# EasyEDA Pro project Tracer-DIY.epro

# Schematic Tracer-DIY
Board Name: Tracer-DIY; Create Date: 2025-10-20; Page Name: P1; Project Name: Tracer; Schematic Name: Tracer-DIY; Update Date: 2025-10-20; Company: EasyEDA.com; Page Size: A4; Version: V1.0
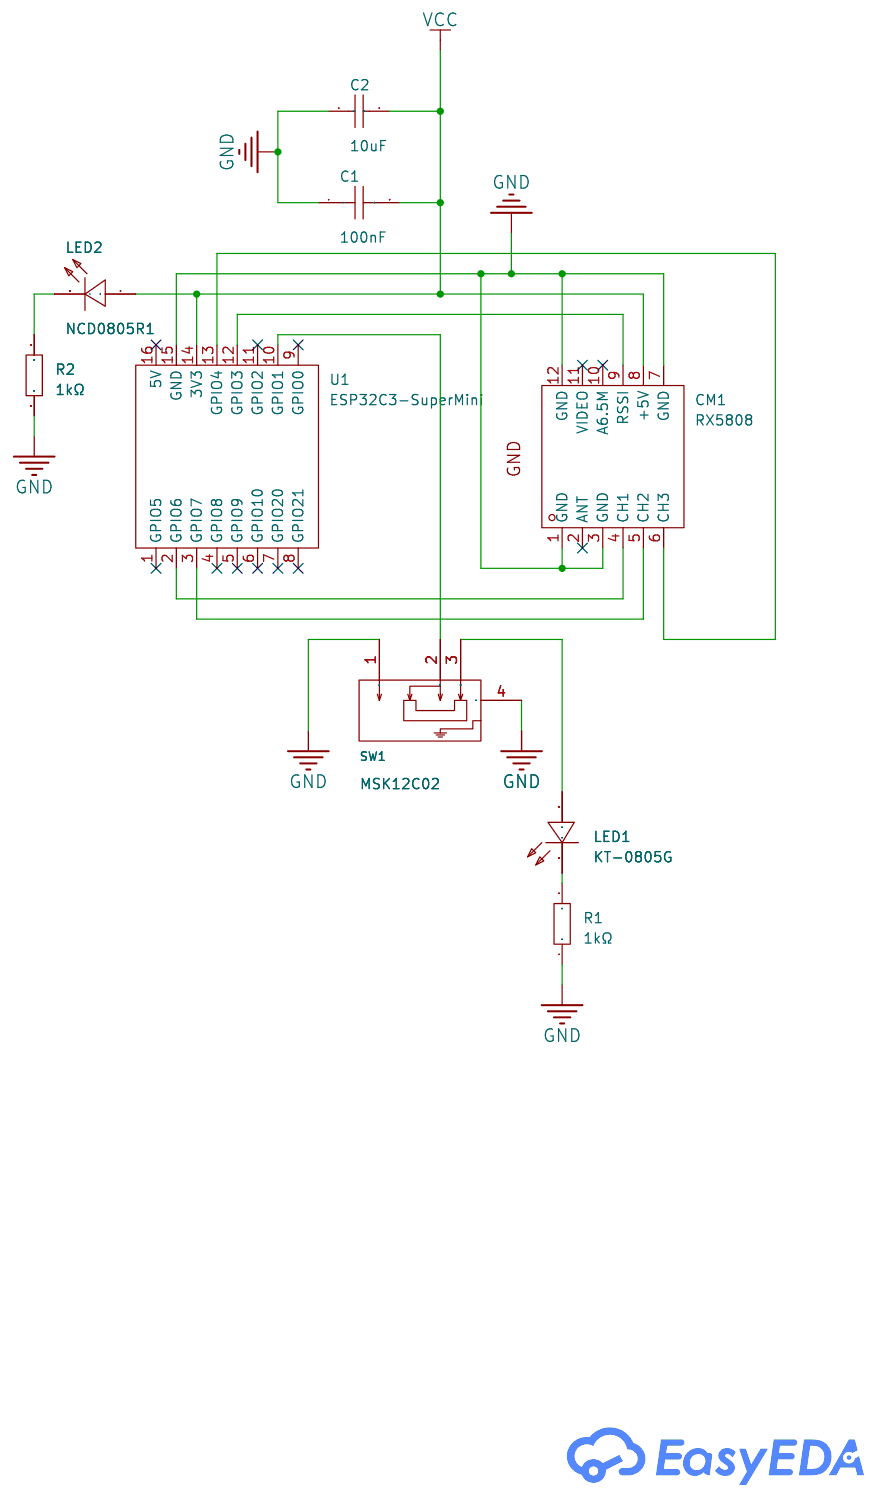
[diagram p0: schematic sheet]

## Parts
C1  100nF  [C0402]
C2  10uF  [C0402]
CM1  RX5808  [COMM-SMD_12P_RX5808]
LED1  KT-0805G  [LED0805-R-RD]
LED2  NCD0805R1  [LED0805-R-RD]
R1  1kΩ  [R0402]
R2  1kΩ  [R0402]
SW1  MSK12C02  [SW-TH_MSK12C02]
U1  ESP32C3-SuperMini  [COMM-SMD_16P-L22.5-W18.0-P2.54-TL]

## Library data of the parts
C1 = CL05B104KB54PNC: Capacitance:100nF Tolerance:±10% Tolerance:±10% Voltage Rating:50V Temperature Coefficient:X7R; LCSC Part Name: 100nF ±10% 50V; Supplier Part: C307331; Manufacturer: SAMSUNG(三星); Supplier Footprint: 0402; JLCPCB Part Class: Basic Part; Datasheet: https://item.szlcsc.com/datasheet/CL05B104KB54PNC/291005.html; Supplier: LCSC; Tolerance: ±10%; Voltage Rating: 50V; Temperature Coefficient: X7R
C2 = CL05A106MQ5NUNC: Capacitance:10uF Tolerance:±20% Tolerance:±20% Voltage Rating:6.3V Temperature Coefficient:X5R; LCSC Part Name: 10uF ±20% 6.3V; Supplier Part: C15525; Manufacturer: SAMSUNG(三星); Supplier Footprint: 0402; JLCPCB Part Class: Basic Part; Datasheet: https://item.szlcsc.com/datasheet/CL05A106MQ5NUNC/16204.html; Supplier: LCSC; Tolerance: ±20%; Voltage Rating: 6.3V; Temperature Coefficient: X5R
CM1 = RX5808: Supplier Part: C2908157; Supplier Footprint: SMD-12_23.0X28.0X2.54P; JLCPCB Part Class: Extended Part; Supplier: LCSC
LED1 = KT-0805G: Lamp Holder Type:- Illumination Color:Emerald Green Voltage - Forward(Vf):2.6V~3.1V Voltage - Forward(Vf):2.6V~3.1V Power(Watts):100mW Forward Current:5mA Wavelength - Dominant:513nm~528nm Wavelength - Dominant:513nm~528nm Peak Wavelength:525nm Diode Conf; LCSC Part Name: 0805 翠绿 高亮; Supplier Part: C2297; Manufacturer: KENTO; Supplier Footprint: 0805; JLCPCB Part Class: Basic Part; Datasheet: https://item.szlcsc.com/datasheet/KT-0805G/2670.html; Supplier: LCSC; Illumination Color: Emerald Green; Voltage - Forward(Vf): 2.6V~3.1V; Power(Watts): 100mW; Forward Current: 5mA; Wavelength - Dominant: 513nm~528nm; Peak Wavelength: 525nm; Luminous Intensity: 430mcd; Viewing Angle: 120°; Operating Temperature: -40℃~+85℃
LED2 = NCD0805R1_C84256: Lamp Holder Type:- Emitted Color:Red Forward Voltage (VF):1.6V~2.6V Forward Voltage (VF):1.6V~2.6V Power Dissipation:65mW Forward Current:20mA Dominant Wavelength:615nm~630nm Dominant Wavelength:615nm~630nm Peak Wavelength:- Diode Configuration:独立二极管 Lens; Supplier Part: C84256; Manufacturer: 国星光电; Supplier Footprint: 0805; JLCPCB Part Class: Basic Part; Datasheet: https://atta.szlcsc.com/upload/public/pdf/source/20200820/C84256_F0A75A43B3EAD75808600A0514C76B99.pdf; Supplier: LCSC; Emitted Color: Red; Forward Voltage (VF): 1.6V~2.6V; Power Dissipation: 65mW; Forward Current: 20mA; Dominant Wavelength: 615nm~630nm; Diode Configuration: 独立二极管; Lens Color: 无色透明透镜; Luminous Intensity: 67mcd~195mcd; Viewing Angle: 130°; Operating Temperature: -30℃~+85℃
R1 R2 = 0402WGF1001TCE: Type:Thick Film Resistor Resistance:1kΩ Tolerance:±1% Tolerance:±1% Power(Watts):62.5mW Voltage-Supply(Max):50V Temperature Coefficient:±100ppm/℃ Temperature Coefficient:±100ppm/℃ Operating Temperature:-55℃~+155℃ Operating Temperature:-55℃~+155℃; LCSC Part Name: 1kΩ ±1% 62.5mW 厚膜电阻; Supplier Part: C11702; Manufacturer: UNI-ROYAL(厚声); Supplier Footprint: 0402; JLCPCB Part Class: Basic Part; Datasheet: https://item.szlcsc.com/datasheet/0402WGF1001TCE/12256.html; Supplier: LCSC; Type: Thick Film Resistor; Tolerance: ±1%; Power(Watts): 62.5mW; Voltage-Supply(Max): 50V; Temperature Coefficient: ±100ppm/℃; Operating Temperature: -55℃~+155℃
SW1 = MSK12C02: Circuit:SPDT Actuator Style:- Termination Style:SMD(SMT) Tab Length:8mm Width:2.8mm Switch Height:1.4mm Mounting Type:Surface Mount, Right Angle Actuator Color:- Current Rating:50mA Voltage Rating:12V Life:10,000 Cycles Operating Temperature:-20℃~+70℃ Ope; LCSC Part Name: 两档侧拨贴片 7脚 滑动开关; Supplier Part: C431540; Manufacturer: SHOU HAN(首韩); Supplier Footprint: SMD,8x2.8mm; JLCPCB Part Class: Extended Part; Datasheet: https://item.szlcsc.com/datasheet/MSK12C02/427897.html; Supplier: LCSC; Circuit: SPDT; Termination Style: SMD(SMT) Tab; Length: 8mm; Width: 2.8mm; Switch Height: 1.4mm; Mounting Type: Surface Mount, Right Angle; Current Rating: 50mA; Voltage Rating: 12V; Life: 10,000 Cycles; Operating Temperature: -20℃~+70℃
U1 = ESP32C3-SuperMini: Supplier Part: C9900147397; Supplier Footprint: SMD-16P; JLCPCB Part Class: Extended Part; Supplier: LCSC

## Nets
GND: C1.1 C2.1 CM1.1(GND) CM1.3(GND) CM1.7(GND) CM1.12(GND) R1.1 R2.2 SW1.1 SW1.4 U1.15(GND)
VCC: C1.2 C2.2 CM1.8(+5V) LED2.1(+) U1.14(3V3)
$1N355: CM1.9(RSSI) U1.12(GPIO3)
$1N426: CM1.4(CH1) U1.2(GPIO6)
$1N432: CM1.5(CH2) U1.3(GPIO7)
$1N438: CM1.6(CH3) U1.13(GPIO4)
$1N594: LED1.1(A) SW1.3
$1N700: LED1.2(K) R1.2
$1N724: SW1.2 U1.10(GPIO1)
$1N865: LED2.2(-) R2.1

Not connected (* = marked no-connect by the designer): CM1 2(ANT)* 10(A6.5M)* 11(VIDEO)*; U1 1(GPIO5)* 4(GPIO8)* 5(GPIO9)* 6(GPIO10)* 7(GPIO20)* 8(GPIO21)* 9(GPIO0)* 11(GPIO2)* 16(5V)*

# Board Tracer-DIY
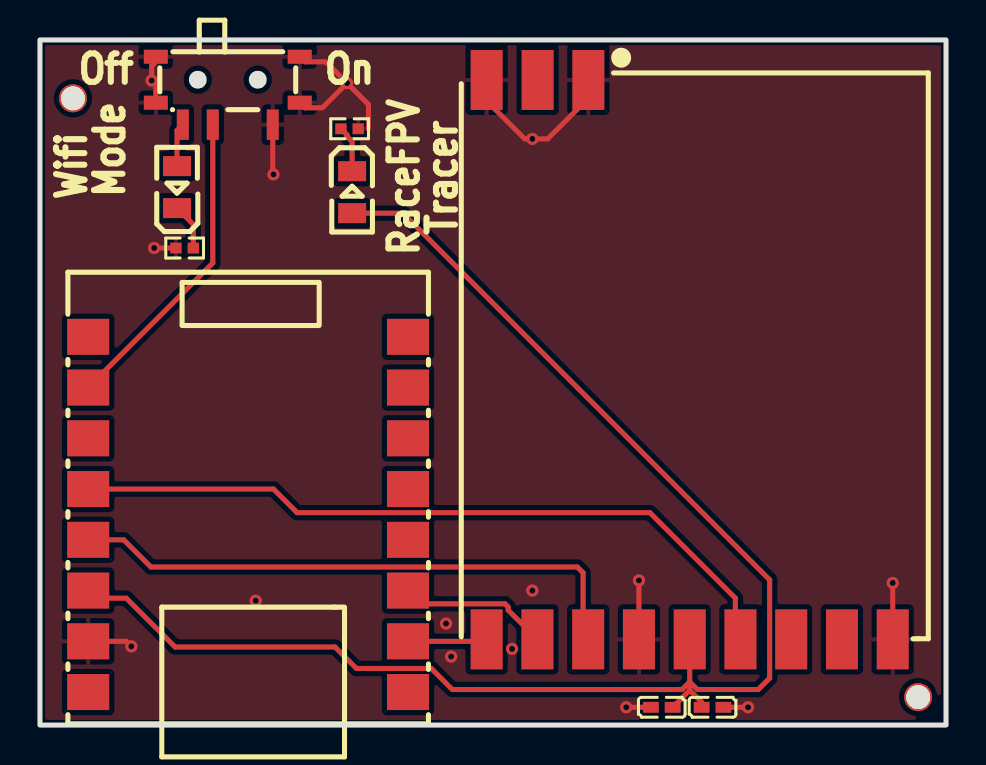
[diagram p1: board, top side]
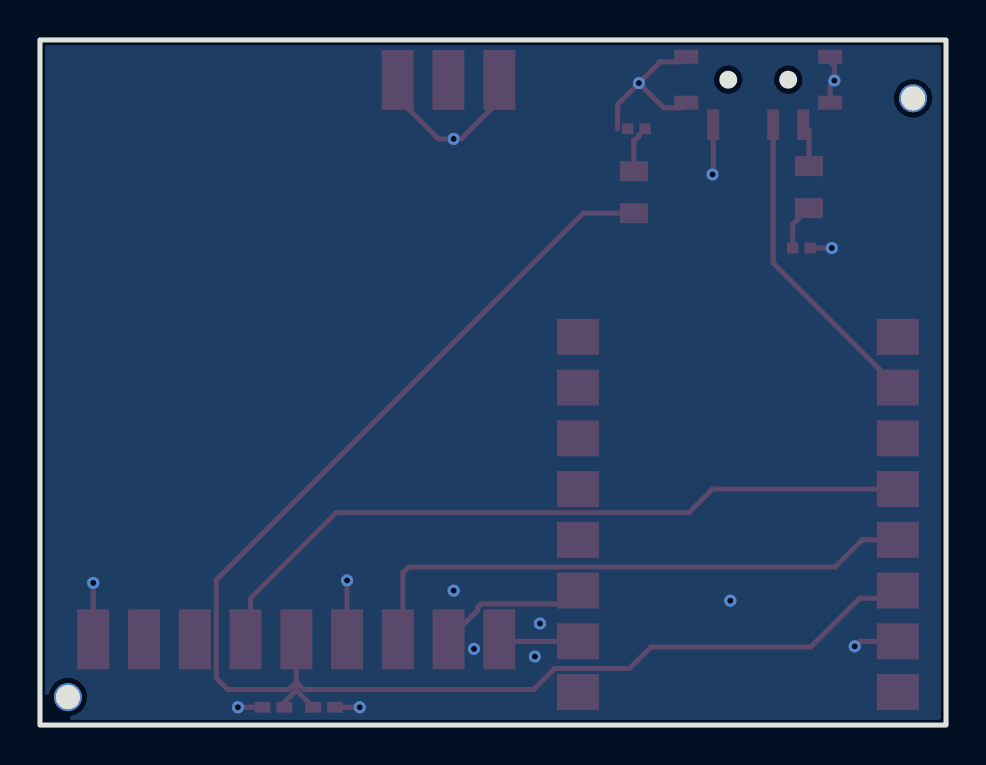
[diagram p2: board, bottom side, seen from below]

Outline 45.34 x 34.29 mm; copper layers: Top Layer, Bottom Layer. Coordinates in mm from the lower left corner of the outline.
Outline path: rectangle 0,34.29 45.34,0
Stack: Top Layer 0.035mm / Dielectric1 1.51mm FR4 er 4.5 / Bottom Layer 0.035mm

## Design rules (mm)
template: JLCPCB Capability(Two Layers Board)
spacing copperThickness1oz (default): track to track 0.102, other pairs 0.152 to 0.3
spacing copperThickness2oz: track to track 0.203, other pairs 0.152 to 0.3
track width copperThickness1oz (default): min 0.127, default 0.254, max 2.54
track width copperThickness2oz: min 0.203, default 0.254, max 2.54
differential pair differentialPair (default): width min 0.127, default 0.254, max 2.54; gap min 0.152, default 0.152
via viaSize (default): diameter min 0.5, default 0.61, max 10; hole min 0.3, default 0.305, max 6.3

## Placement (name value [footprint] x y rotation side)
C1  100nF  [C0402]  33.66 0.89 180 top
C2  10uF  [C0402]  31.11 0.89 0 top
CM1  RX5808  [COMM-SMD_12P_RX5808]  32.51 18.29 270 top
LED1  KT-0805G  [LED0805-R-RD]  6.86 26.92 90 top
LED2  NCD0805R1  [LED0805-R-RD]  15.62 26.67 270 top
NOREF  -  [Pad_e582]  43.94 1.4 0 top
NOREF#2  -  [Pad_e579]  1.65 31.37 0 top
R1  1kΩ  [R0402]  7.24 23.88 0 top
R2  1kΩ  [R0402]  15.49 29.84 0 top
SW1  MSK12C02  [SW-TH_MSK12C02]  9.4 31.75 180 top
U1  ESP32C3-SuperMini  [COMM-SMD_16P-L22.5-W18.0-P2.54-TL]  10.41 10.54 180 top

## Footprints (pads in the part's own frame, mm; a bottom-side part is the same pattern mirrored in y, then rotated)
C0402
  rect 0.79x0.54 smd: 1(-0.545,0) 2(0.545,0)
COMM-SMD_12P_RX5808
  rect 3x1.6 smd: 1(-14,-5.07) 2(-14,-7.61) 3(-14,-10.16) 4(14,-10.16) 5(14,-7.62) 6(14,-5.08) 7(14,-2.54) 8(14,0) 9(14,2.54) 10(14,5.08) 11(14,7.62) 12(14,10.16)
COMM-SMD_16P-L22.5-W18.0-P2.54-TL
  rect 2.102x1.802 smd: 1(-8.001,8.89) 2(-8.001,6.35) 3(-8.001,3.81) 4(-8.001,1.27) 5(-8.001,-1.27) 6(-8.001,-3.81) 7(-8.001,-6.35) 8(-8.001,-8.89) 9(8.001,-8.89) 10(8.001,-6.35) 11(8.001,-3.81) 12(8.001,-1.27) 13(8.001,1.27) 14(8.001,3.81) 15(8.001,6.35) 16(8.001,8.89)
LED0805-R-RD
  rect 1x1.399 smd: 1(1.05,0) 2(-1.05,0)
Pad_e579
  round 1.4 hole 1.2: M1(0,0)
Pad_e582
  round 1.4 hole 1.2: M1(0,0)
R0402
  rect 0.566x0.54 smd: 1(-0.433,0) 2(0.433,0)
SW-TH_MSK12C02
  rect 0.6x1.524 smd: 1(-2.25,1.7) 2(0.75,1.7) 3(2.25,1.7)
  rect 1.2x0.7 smd: 4(-3.6,0.6) 4(-3.6,-1.7) 4(3.6,0.6) 4(3.6,-1.7)

## Nets
As in the schematic.

Pads without a net: CM1 2 10 11; NOREF M1; NOREF#2 M1; U1 1 4 5 6 7 8 9 11 16

## Via types
v1: diameter 0.61, hole 0.305, Top Layer to Bottom Layer, 15 vias

## Routing (per net, layer and track width the routed paths; a pad name or vN(x,y) marks a point on that pad's centre or on a via; arc(x,y) is an arc through that point)
GND: length 33.6
  Top Layer w0.254: 2.41,4.19 4.32,4.19 v1(4.57,3.94) ; v1(11.68,27.56) 11.65,27.59 11.65,29.8 ; C1.1 v1(35.43,0.89) ; 6.81,23.88 v1(5.72,23.88) ; v1(15.37,32.13) 16.44,31.06 16.44,29.84 ; v1(15.37,32.13) 14.13,30.9 13.25,30.9 SW1.4 ; v1(15.37,32.13) 14.3,33.2 13.25,33.2 SW1.4 ; CM1.3 22.35,31.24 24.26,29.34 v1(24.64,29.34) 25.4,29.34 27.44,31.38 27.44,32.29 ; SW1.4 5.8,33.2 5.59,32.99 v1(5.59,32.26) 5.8,32.05 SW1.4 ; CM1.12 v1(42.67,7.11) ; CM1.7 v1(29.97,7.24) ; v1(29.34,0.89) C2.1
  vias: v1(10.79,6.22) v1(20.32,5.08) v1(20.57,3.43) v1(23.62,3.81) v1(24.64,6.73)
VCC: length 75
  Top Layer w0.254: LED2.1 18.16,25.62 36.51,7.27 36.51,2.35 35.94,1.78 32.89,1.78 32.51,2.16 ; CM1.8 32.51,2.16 ; 32.51,2.16 32.51,1.74 ; 32.51,2.16 32.13,1.78 20.63,1.78 19.58,2.83 15.84,2.83 14.76,3.91 6.76,3.91 4.32,6.35 2.79,6.35 U1.14 ; 32.51,1.74 33.11,1.14 33.11,0.89 ; 32.51,1.74 31.66,0.89
$1N355: length 36.8
  Top Layer w0.254: U1.12 11.68,11.81 12.86,10.63 30.52,10.63 34.8,6.35 34.8,4.54 CM1.9
$1N426: length 4
  Top Layer w0.254: CM1.4 22.25,4.19 18.41,4.19
$1N432: length 7.6
  Top Layer w0.254: CM1.5 23.43,5.75 23.43,5.9 23.27,6.07 19.08,6.07 U1.3
$1N438: length 28.9
  Top Layer w0.254: U1.13 4.19,9.27 5.55,7.91 26.89,7.91 27.18,7.62 27.18,4.54 CM1.6
$1N594: length 2.2
  Top Layer w0.254: LED1.1 6.86,29.76 SW1.3
$1N700: length 2.3
  Top Layer w0.254: LED1.2 7.67,25.06 R1.2
$1N724: length 15.5
  Top Layer w0.254: 8.65,29.8 8.65,23.13 U1.10
$1N865: length 2.4
  Top Layer w0.254: R2.1 15.36,29.54 15.36,29.46 15.53,29.3 15.61,29.3 15.62,29.28 LED2.2

## Copper pours and planes (outline as drawn; the poured copper is in the pictures)
GND on Top Layer: -1.78,37.59 46.35,37.59 46.35,-3.3 -1.78,-3.3
GND on Bottom Layer: -0.89,38.99 47.62,38.99 47.62,-1.78 -0.89,-1.78

## Text on the board
Top Silkscreen Layer: Wifi | Mode | Off | On | RaceFPV | Tracer
